# Altium schematic sheet devresematik.SchDoc
size A4
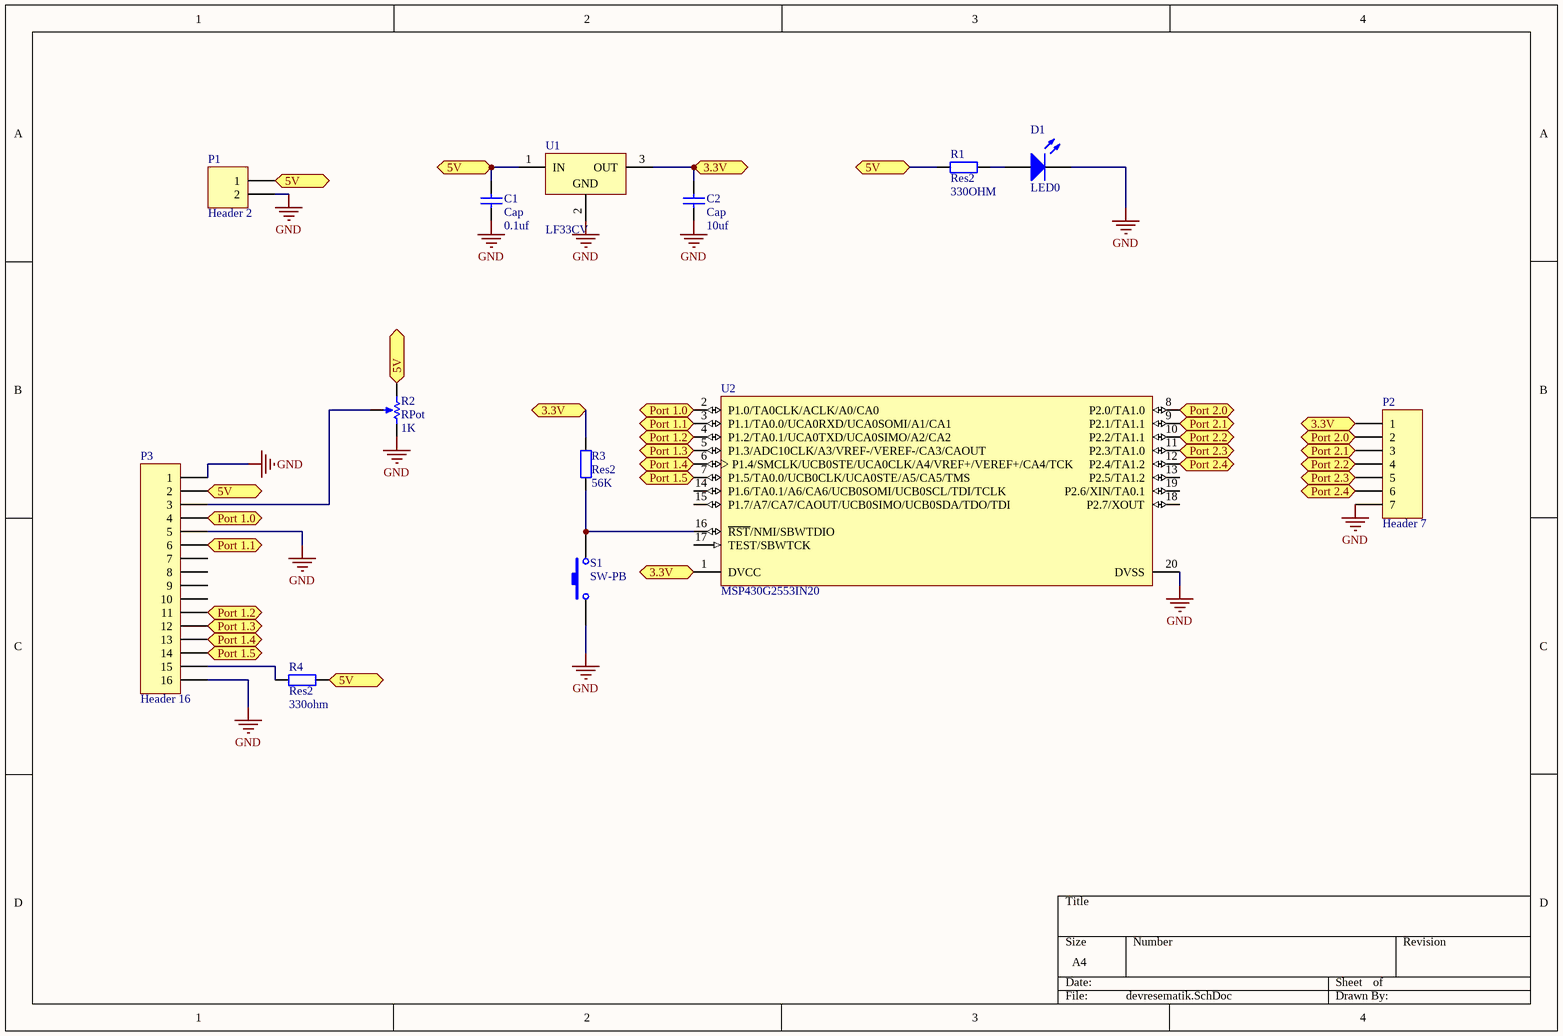
[diagram p0: devresematik.SchDoc]

## Parts
C1  Cap  value 0.1uf  [RAD-0.3]
C2  Cap  value 10uf  [RAD-0.3]
D1  LED0  [LED-0]
P1  Header 2  [HDR1X2]
P2  Header 7  [HDR1X7]
P3  Header 16  [HDR1X16]
R1  Res2  value 330OHM  [AXIAL-0.4]
R2  RPot  value 1K  [VR5]
R3  Res2  value 56K  [AXIAL-0.4]
R4  Res2  value 330ohm  [AXIAL-0.4]
S1  SW-PB  [SPST-2]
U1  LF33CV  [TO-220A]
U2  MSP430G2553IN20  [TI-N20]

## Ports
3.3V, 5V, Port 1.0, Port 1.1, Port 1.2, Port 1.3, Port 1.4, Port 1.5, Port 2.0, Port 2.1, Port 2.2, Port 2.3, Port 2.4

## Nets
GND: C1.1 C2.1 D1.2(K) P1.2 P2.7 P3.1 P3.5 P3.16 R2.2(BOT) S1.1 U1.2(GND) U2.20(DVSS)
3.3V: C2.2 P2.1 R3.1 U1.3(OUT) U2.1(DVCC) ; port 3.3V
5V: C1.2 P1.1 P3.2 R1.2 R2.1(TOP) R4.2 U1.1(IN) ; port 5V
Port 1.0: P3.4 U2.2(P1.0/TA0CLK/ACLK/A0/CA0) ; port Port 1.0
Port 1.1: P3.6 U2.3(P1.1/TA0.0/UCA0RXD/UCA0SOMI/A1/CA1) ; port Port 1.1
Port 1.2: P3.11 U2.4(P1.2/TA0.1/UCA0TXD/UCA0SIMO/A2/CA2) ; port Port 1.2
Port 1.3: P3.12 U2.5(P1.3/ADC10CLK/A3/VREF-/VEREF-/CA3/CAOUT) ; port Port 1.3
Port 1.4: P3.13 U2.6(P1.4/SMCLK/UCB0STE/UCA0CLK/A4/VREF+/VEREF+/CA4/TCK) ; port Port 1.4
Port 1.5: P3.14 U2.7(P1.5/TA0.0/UCB0CLK/UCA0STE/A5/CA5/TMS) ; port Port 1.5
Port 2.0: P2.2 U2.8(P2.0/TA1.0) ; port Port 2.0
Port 2.1: P2.3 U2.9(P2.1/TA1.1) ; port Port 2.1
Port 2.2: P2.4 U2.10(P2.2/TA1.1) ; port Port 2.2
Port 2.3: P2.5 U2.11(P2.3/TA1.0) ; port Port 2.3
Port 2.4: P2.6 U2.12(P2.4/TA1.2) ; port Port 2.4
NetD1_1: D1.1(A) R1.1
NetP3_3: P3.3 R2.3(TAP)
NetP3_15: P3.15 R4.1
NetR3_2: R3.2 S1.2 U2.16(~{RST}/NMI/SBWTDIO)

Not connected (* = marked no-connect by the designer): P3 7 8 9 10; U2 13(P2.5/TA1.2) 14(P1.6/TA0.1/A6/CA6/UCB0SOMI/UCB0SCL/TDI/TCLK) 15(P1.7/A7/CA7/CAOUT/UCB0SIMO/UCB0SDA/TDO/TDI) 17(TEST/SBWTCK) 18(P2.7/XOUT) 19(P2.6/XIN/TA0.1)

## Library data of the parts
C1 C2 = Cap: Capacitor; Published: 8-Jun-2000; LatestRevisionDate: 17-Jul-2002; LatestRevisionNote: Re-released for DXP Platform.; PackageReference: RAD-0.3; Publisher: Altium Limited; PackageDescription: Radial Cap, Thru-Hole; 2 Leads; 0.3 in Pin Spacing
D1 = LED0: Typical INFRARED GaAs LED; Published: 8-Jun-2000; LatestRevisionDate: 08-Jul-2005; LatestRevisionNote: Mech Layer 1 removed.; PackageReference: LED-0; Publisher: Altium Limited; PackageDescription: LED; 2 Leads
P1 = Header 2: Header, 2-Pin; LatestRevisionDate: 17-Jul-2002; LatestRevisionNote: Re-released for DXP Platform.; Publisher: Altium Limited
P2 = Header 7: Header, 7-Pin; LatestRevisionDate: 17-Jul-2002; LatestRevisionNote: Re-released for DXP Platform.; Publisher: Altium Limited
P3 = Header 16: Header, 16-Pin; LatestRevisionDate: 17-Jul-2002; LatestRevisionNote: Re-released for DXP Platform.; Publisher: Altium Limited
R1 R3 R4 = Res2: Resistor; Published: 8-Jun-2000; LatestRevisionDate: 17-Jul-2002; LatestRevisionNote: Re-released for DXP Platform.; PackageReference: AXIAL-0.4; Publisher: Altium Limited; PackageDescription: Axial Device, Thru-Hole; 2 Leads; 0.4 in Pin Spacing
R2 = RPot: Potentiometer; Sim Note: Enter the Resistance value and the set point into parameter fields.; Set Position: 0.5; Published: 8-Jun-2000; LatestRevisionDate: 17-Jul-2002; LatestRevisionNote: Re-released for DXP Platform.; PackageReference: VR5; Publisher: Altium Limited; PackageDescription: Variable Resistor, Thru-Hole; 3 Leads
S1 = SW-PB: Switch; Published: 24-Mar-1999; LatestRevisionDate: 17-Jul-2002; LatestRevisionNote: Re-released for DXP Platform.; PackageReference: SPST-2; Publisher: Altium Limited; PackageDescription: Switch; 2 Leads
U1 = LF33CV: 500mA, Very Low Drop (0.45V) Voltage Regulator; Published: 24-Aug-2001; LatestRevisionDate: 06-Jun-2005; LatestRevisionNote: PCB Pin sequence re-ordered.; DatasheetVersion: Feb-2004; PackageVersion: Jul-2004; PackageReference: TO-220A; Publisher: Altium Limited; PackageDescription: TO, Thru-Hole, Vertical, Heatsink Mounted; 3 In-Line Leads; Pitch 2.54 mm; ComponentLink1Description: Manufacturer Link; ComponentLink1URL: http://www.st.com/; ComponentLink2Description: Datasheet; ComponentLink2URL: http://www.st.com/stonline/books/pdf/docs/2574.pdf
U2 = MSP430G2553IN20: 16 MHz Mixed Signal Microcontroller with 16 KB Flash, 512 B SRAM and 24 GPIOs, -40 to 85 degC, 20-pin DIP (N), Pb-Free (RoHS); Manufacturer: Texas Instruments; ADC: 10-bit SAR; ADC Channels: 8; Brown Out Reset: Yes; Flash(KB): 16; GPIO: 24; SRAM(B): 512; SubFamily: Value Line; Timers - 16-bit: 2; USCI_A (UART/LIN/IrDA/SPI): 1; DatasheetVersion: SLAS735G; PackageVersion: 4040049/E; PackageReference: N20; PackageDescription: 20-Pin Plastic In-Line, Body 25.40 x 6.35 mm, Pitch 2.54 mm; Supplier 1: Digi-Key; Supplier Part Number 1: MSP430G2533IRHB32T-ND; Supplier 2: Mouser; Supplier Part Number 2: 595-P430G2533IRHB32T; Cap touch I/O: Yes; Comparators: Yes; Eco-Plan: Pb-Free (RoHS); Frequency(MHz): 16; Temp Sensor: Yes; USCI_B (I2C & SPI): 1; Watchdog: Yes; Mounting Technology: Through Hole; Code_JEDEC: MS-001; PartNumber: MSP430G2553IN20; ComponentLink1Description: Manufacturer URL; ComponentLink1URL: http://www.ti.com/; ComponentLink2Description: Datasheet; ComponentLink2URL: http://www.ti.com/general/docs/lit/getliterature.tsp?genericPartNumber=MSP430G2553&fileType=pdf; ComponentLink3Description: Package Specification; ComponentLink3URL: http://www.ti.com/litv/pdf/mpds177g